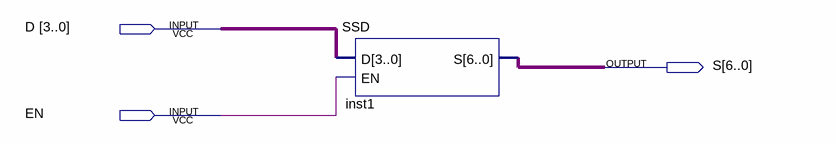
[diagram p0: schematic sheet]
// Quartus schematic Project3.bdf as structural Verilog: 1 symbols, 3 pins
module Project3 (
  input  [3:0] D,
  input  EN,
  output [6:0] S
);

  SSD inst1 (.D(D), .EN(EN), .S(S));
endmodule
